# EAGLE design untitled (EAGLE 9.0.1)
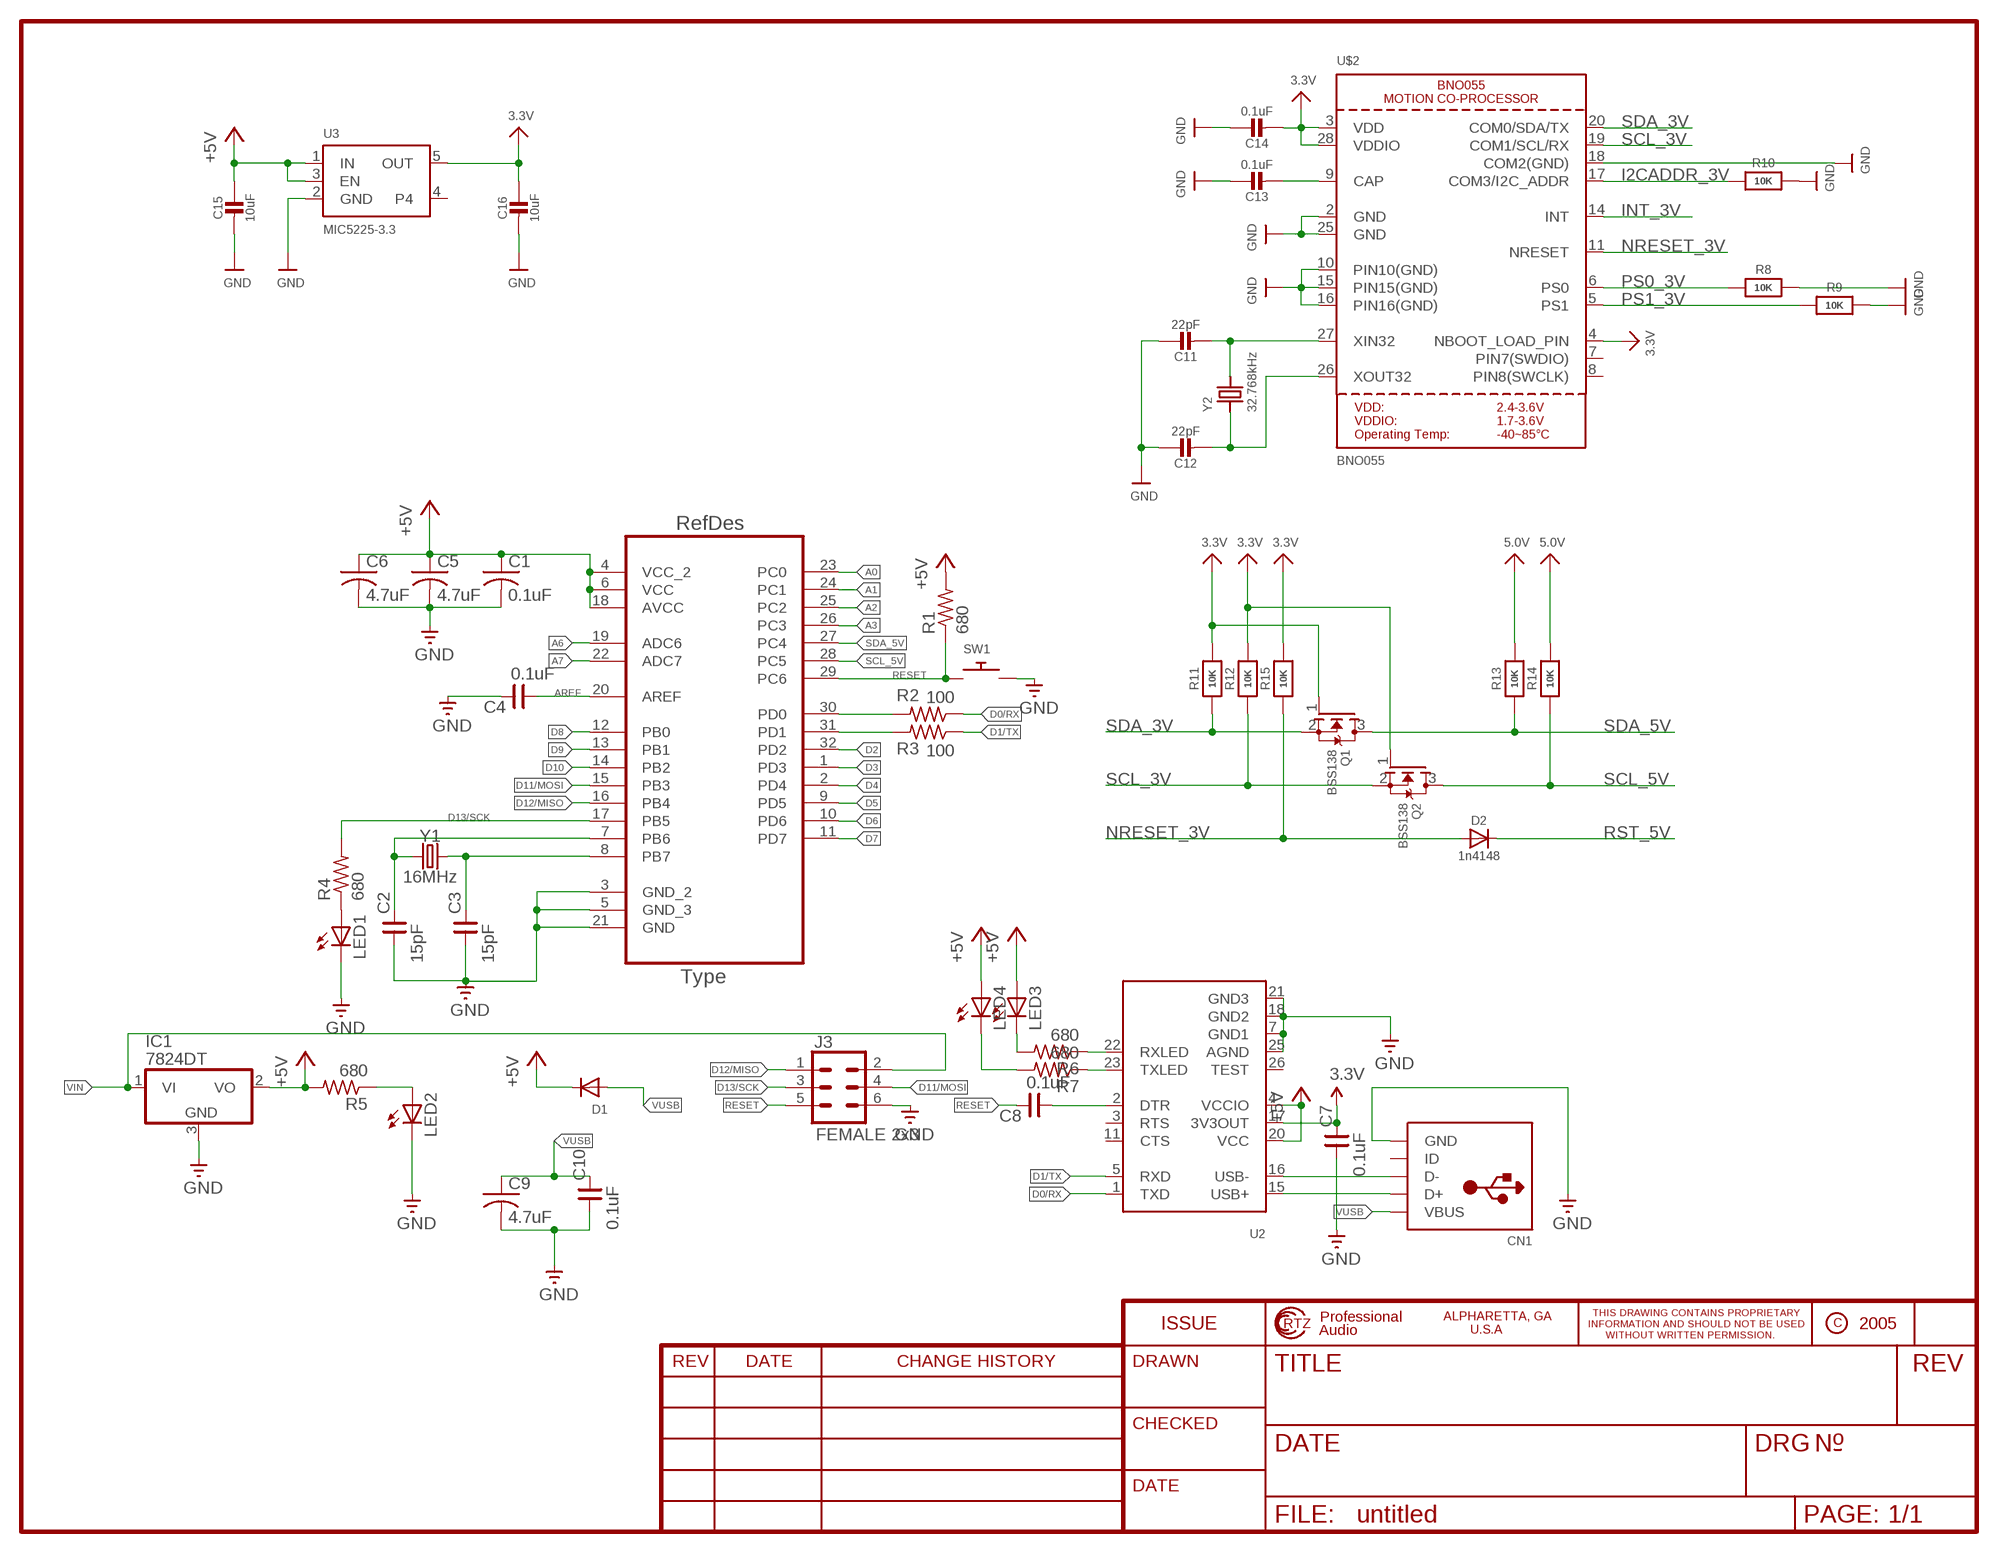
[diagram p0: schematic, sheet 1]

## Parts
C1  0.1uF  C-USC0805  [C0805]
C2  15pF  CNP-0805  [0805]
C3  15pF  CNP-0805  [0805]
C4  0.1uF  CNP-0805  [0805]
C5  4.7uF  C-USC0805  [C0805]
C6  4.7uF  C-USC0805  [C0805]
C7  0.1uF  CNP-0805  [0805]
C8  0.1uF  CNP-0805  [0805]
C9  4.7uF  C-USC0805  [C0805]
C10  0.1uF  CNP-0805  [0805]
C11  22pF  CAP_CERAMIC0805-NOOUTLINE  [0805-NO]
C12  22pF  CAP_CERAMIC0805-NOOUTLINE  [0805-NO]
C13  0.1uF  CAP_CERAMIC0805-NOOUTLINE  [0805-NO]
C14  0.1uF  CAP_CERAMIC0805_10MGAP  [0805_10MGAP]
C15  10uF  CAP_CERAMIC0805-NOOUTLINE  [0805-NO]
C16  10uF  CAP_CERAMIC0805_10MGAP  [0805_10MGAP]
CN1  USBMINIB  [USB-MINIB]
D1  DIODESOD-123  [SOD-123]
D2  1n4148  DIODESOD-323  [SOD-323]
IC1  7824DT  [TO252]
J3  FEMALE 2x3  CONN_03X2FEMALE  [2X3]
LED1  LEDCHIPLED_0805  [CHIPLED_0805]
LED2  LEDCHIPLED_0805  [CHIPLED_0805]
LED3  LEDCHIPLED_0805  [CHIPLED_0805]
LED4  LEDCHIPLED_0805  [CHIPLED_0805]
Q1  BSS138  MOSFET-NWIDE  [SOT23-WIDE]
Q2  BSS138  MOSFET-NWIDE  [SOT23-WIDE]
R1  680  R-US_R0805  [R0805]
R2  100  R-US_R0805  [R0805]
R3  100  R-US_R0805  [R0805]
R4  680  R-US_R0805  [R0805]
R5  680  R-US_R0805  [R0805]
R6  680  R-US_R0805  [R0805]
R7  680  R-US_R0805  [R0805]
R8  10K  RESISTOR0805_NOOUTLINE  [0805-NO]
R9  10K  RESISTOR0805_NOOUTLINE  [0805-NO]
R10  10K  RESISTOR0805_NOOUTLINE  [0805-NO]
R11  10K  RESISTOR0805_NOOUTLINE  [0805-NO]
R12  10K  RESISTOR0805_NOOUTLINE  [0805-NO]
R13  10K  RESISTOR_0805MP  [_0805MP]
R14  10K  RESISTOR_0805MP  [_0805MP]
R15  10K  RESISTOR0805_NOOUTLINE  [0805-NO]
SW1  SWITCH_PUSHBUTTONEVQ-PE  [TACT_PANA-EVQ]
U1  ATMEGA328P-AU  [QFP80P900X900X120-32N]
U2  FT232RLSSOP28  [SSOP28DB]
U3  MIC5225-3.3  VREG_SOT23-5  [SOT23-5]
U$2  BNO055  [BNO055]
Y1  16MHz  CRYSTAL-16MHZPTH-HC49US  [HC49US]
Y2  32.768kHz  CRYSTAL8.0X3.8  [CRYSTAL_8X3.8]

## Nets
3.3V: C7.2 C14.2 C16.1 Q1.1(G) Q2.1(G) R11.2 R12.2 R15.2 U2.17(3V3OUT) U3.5(OUT) U$2.3(VDD) U$2.4(NBOOT_LOAD_PIN) U$2.28(VDDIO)
5.0V: R13.2 R14.2
+5V: C1.1 C5.1 C6.1 C15.1 D1.C IC1.2(VO) LED3.A LED4.A R5.2 U1.4(VCC_2) U1.6(VCC) U1.18(AVCC) U2.4(VCCIO) U2.20(VCC) U3.1(IN) U3.3(EN)
A0: U1.23(PC0)
A1: U1.24(PC1)
A2: U1.25(PC2)
A3: U1.26(PC3)
A6: U1.19(ADC6)
A7: U1.22(ADC7)
AREF: C4.1 U1.20(AREF)
D0/RX: R2.1 U2.1(TXD)
D1/TX: R3.1 U2.5(RXD)
D2: U1.32(PD2)
D3: U1.1(PD3)
D4: U1.2(PD4)
D5: U1.9(PD5)
D6: U1.10(PD6)
D7: U1.11(PD7)
D8: U1.12(PB0)
D9: U1.13(PB1)
D10: U1.14(PB2)
D11/MOSI: J3.4 U1.15(PB3)
D12/MISO: J3.1 U1.16(PB4)
D13/SCK: J3.3 R4.2 U1.17(PB5)
GND: C1.2 C2.1 C3.1 C4.2 C5.2 C6.2 C7.1 C9.2 C10.1 C11.1 C12.1 C13.1 C14.1 C15.2 C16.2 CN1.GND IC1.3(GND) J3.6 LED1.C LED2.C R8.2 R9.2 R10.2 SW1.P$2 U1.3(GND_2) U1.5(GND_3) U1.21(GND) U2.7(GND1) U2.18(GND2) U2.21(GND3) U2.25(AGND) U3.2(GND) U$2.2(GND) U$2.10(PIN10(GND)) U$2.15(PIN15(GND)) U$2.16(PIN16(GND)) U$2.18(COM2(GND)) U$2.25(GND)
I2CADDR_3V: R10.1 U$2.17(COM3/I2C_ADDR)
INT_3V: U$2.14(INT)
N$1: C3.2 U1.8(PB7) Y1.2
N$2: C2.2 U1.7(PB6) Y1.1
N$4: LED2.A R5.1
N$5: CN1.D+ U2.15(USB+)
N$6: CN1.D- U2.16(USB-)
N$7: R2.2 U1.30(PD0)
N$8: R3.2 U1.31(PD1)
N$9: LED3.C R6.2
N$10: C11.2 U$2.27(XIN32) Y2.P$4
N$11: C12.2 U$2.26(XOUT32) Y2.P$1
N$12: R6.1 U2.22(RXLED)
N$13: R7.1 U2.23(TXLED)
N$14: C8.1 U2.2(DTR)
N$15: LED4.C R7.2
N$16: C13.2 U$2.9(CAP)
NRESET_3V: D2.A R15.1 U$2.11(NRESET)
PS0_3V: R8.1 U$2.6(PS0)
PS1_3V: R9.1 U$2.5(PS1)
RESET: C8.2 J3.5 R1.1 SW1.P$1 U1.29(PC6)
RST_5V: D2.C
SCL_3V: Q2.2(S) R12.1 U$2.19(COM1/SCL/RX)
SCL_5V: Q2.3(D) R14.1 U1.28(PC5)
SDA_3V: Q1.2(S) R11.1 U$2.20(COM0/SDA/TX)
SDA_5V: Q1.3(D) R13.1 U1.27(PC4)
VIN: IC1.1(VI) J3.2
VUSB: C9.1 C10.2 CN1.VBUS D1.A
Unconnected: CN1.ID LED1.A R1.2 R4.1 U2.3(RTS) U2.11(CTS) U2.26(TEST) U3.4 U$2.7(PIN7(SWDIO)) U$2.8(PIN8(SWCLK))

## Library data of the parts
C1 C5 C6 C9 = adafruit:C-US: CAPACITOR, American symbol
C2-C4 C7 C8 C10 = cap-master:CNP-: NON-POLARIZED CAP
C11-C16 = microbuilder:CAP_CERAMIC: Ceramic Capacitors For new designs, use the packages preceded by an '_' character since they are more reliable: The following footprints should be used on most boards: _0402 - Standard footprint for regular board layouts _0603 - Standard footprint for regular board layouts _0805 - Standard footprint for regular board layouts _1206 - Standard footprint for regular board layouts For extremely tight-pitch boards where space is at a premium, the following 'micro-pitch' footprints can be used (smaller pads, no silkscreen outline, etc.): _0402MP - Micro-pitch footprint for very dense/compact boards _0603MP - Micro-pitch footprint for very dense/compact boards _0805MP - Micro-pitch footprint for very dense/compact boards _1206MP - Micro-pitch footprint for very dense/compact boards
CN1 = adafruit:USB: USB Connectors USBMINIB - Surface Mount Female Mini-B USB Connector 4UConnector: 06564 By microbuilder.eu Thru-hole RA Female Mini-B USB Connector 4UConnector: 18732 By ladyada.net
D1 = adafruit:DIODE: Diode
D2 = microbuilder:DIODE: Diode
IC1 = adafruit:78*: Positive VOLTAGE REGULATOR Added bigger pads to the TO-92 package
J3 = SparkFun-Connectors:CONN_03X2: Multi connection point. Often used as Generic Header-pin footprint for 0.1 inch spaced/style header connections You can populate with any combo of single row headers, but if you'd like an exact match, check these: Header - 2x3 (Male, 0.1") <https://www.sparkfun.com/products/12807> (PRT-12807) Header - 2x3 (Female, 0.1") <https://www.sparkfun.com/products/13010> (PRT-13010) 2x3 Pin Shrouded Header <https://www.sparkfun.com/products/10877> (PRT-10877) On any of the 0.1 inch spaced packages, you can populate with these: Break Away Headers - Straight <https://www.sparkfun.com/products/116> (PRT-00116) Break Away Male Headers - Right Angle <https://www.sparkfun.com/products/553> (PRT-00553) Female Headers <https://www.sparkfun.com/products/115> (PRT-00115) Break Away Headers - Machine Pin <https://www.sparkfun.com/products/117> (PRT-00117) Break Away Female Headers - Swiss Machine Pin <https://www.sparkfun.com/products/743> (PRT-00743) Special note: the shrouded connector mates well with our 3x2 ribbon cables: Ribbon Crimp Connector - 6-pin (2x3, Female) <https://www.sparkfun.com/products/10651> (PRT-10651) Ribbon Cable - 6 wire (15ft) <https://www.sparkfun.com/products/10646> (PRT-10646); PROD_ID: CONN-11566
LED1-LED4 = adafruit:LED: LED OSRAM: - CHIPLED LG R971, LG N971, LY N971, LG Q971, LY Q971, LO R971, LY R971 LH N974, LH R974 LS Q976, LO Q976, LY Q976 LO Q996 - Hyper CHIPLED LW Q18S LB Q993, LB Q99A, LB R99A - SideLED LS A670, LO A670, LY A670, LG A670, LP A670 LB A673, LV A673, LT A673, LW A673 LH A674 LY A675 LS A676, LA A676, LO A676, LY A676, LW A676 LS A679, LY A679, LG A679 - Hyper Micro SIDELED® LS Y876, LA Y876, LO Y876, LY Y876 LT Y87S - SmartLED LW L88C, LW L88S LB L89C, LB L89S, LG L890 LS L89K, LO L89K, LY L89K LS L896, LA L896, LO L896, LY L896 - TOPLED LS T670, LO T670, LY T670, LG T670, LP T670 LSG T670, LSP T670, LSY T670, LOP T670, LYG T670 LG T671, LOG T671, LSG T671 LB T673, LV T673, LT T673, LW T673 LH T674 LS T676, LA T676, LO T676, LY T676, LB T676, LH T676, LSB T676, LW T676 LB T67C, LV T67C, LT T67C, LS T67K, LO T67K, LY T67K, LW E67C LS E67B, LA E67B, LO E67B, LY E67B, LB E67C, LV E67C, LT E67C LW T67C LS T679, LY T679, LG T679 LS T770, LO T770, LY T770, LG T770, LP T770 LB T773, LV T773, LT T773, LW T773 LH T774 LS E675, LA E675, LY E675, LS T675 LS T776, LA T776, LO T776, LY T776, LB T776 LHGB T686 LT T68C, LB T68C - Hyper Mini TOPLED® LB M676 - Mini TOPLED Santana® LG M470 LS M47K, LO M47K, LY M47K Source: http://www.osram.convergy.de/
Q1 Q2 = microbuilder:MOSFET-N: N-Channel Mosfet LEGEND VDS: Voltage Drain-Source ID: Drain Current RDS(ON): Drain-Source On-State Resistance VGS(TH): Gate-Source Threshold Voltage CISS: Drain-Source Input Capacitance SOT-23 Name VDS ID RDS(ON) VGS(TH) CISS Order Number 2N7002E 60V 260mA 2.5 Ohm 2.5V @ 250uA 26.7pF @ 25V 2N7002ET1GOSTR-ND BSH103 30V 850mA 400 mOhm 400mV @ 1mA 83pF @ 24V BSH103,235-ND BSS138 60V 320mA 1.6 Ohm 1.5V @ 250uA 50pF @ 10V Mouser: 771-BSS138PW115 DMN2075U-7 20V 4.2A 38 mOhm 1V @ 250 uA 594.3pF @ 10V DMN2075U-7DICT-ND * BSS138 good choice for I2C level-shifting POWERPAK 1212-8 Name VDS ID RDS(ON) VGS(TH) CISS Order Number Si7308DN 60V 6A 58 mOhm 3V @ 250uA 665pF @ 15V SI7308DN-T1-E3CT-ND
R1-R7 = adafruit:R-US_: RESISTOR, American symbol
R8-R15 = microbuilder:RESISTOR: Resistors For new designs, use the packages preceded by an '_' character since they are more reliable: The following footprints should be used on most boards: _0402 - Standard footprint for regular board layouts _0603 - Standard footprint for regular board layouts _0805 - Standard footprint for regular board layouts _1206 - Standard footprint for regular board layouts For extremely tight-pitch boards where space is at a premium, the following 'micro-pitch' footprints can be used (smaller pads, no silkscreen outline, etc.): _0402MP - Micro-pitch footprint for very dense/compact boards _0603MP - Micro-pitch footprint for very dense/compact boards _0805MP - Micro-pitch footprint for very dense/compact boards _1206MP - Micro-pitch footprint for very dense/compact boards
SW1 = adafruit:SWITCH_PUSHBUTTON: Buttons SOFTTOUCHSMD_SJ - Soft touch temporary push button (Super Junk Akihabara) Compatible with SKPMANE010 [Mouser: 688-SKPMAN] C&K_KSS = Digikey: KSS221GLFS
U1 = Atmel-ATMEGA328P-AU:ATMEGA328P-AU; DESCRIPTION: 8-bit Microcontroller with In-System Programmable Flash; MPN: ATMEGA328P-AU; OC_FARNELL: 1715486; OC_NEWARK: 14R4631; PACKAGE: TQFP-32; SUPPLIER: Atmel
U2 = microbuilder:FT232RL: FTDI FT232RL USB TO RS232 Converter Digikey: 768-1007-1-ND
U3 = microbuilder:VREG_SOT23-5: SOT23-5 Fixed Voltage Regulators Part Current Out V Out V In V Dropout θJA (°C/W) TJ (°C) Digikey Part No. ADP121 150mA 3.3V 3.4-5.5V 0.09V @ 150mA -- -- ADP121-AUJZ33R7CT-ND ADP121 150mA 3.0V 3.1-5.5V 0.09V @ 150mA -- -- ADP121-AUJZ30R7CT-ND ADP122 300mA 3.3V 3.4-5.5V 0.085V @ 300mA -- -- ADP122AUJZ-3.3-R7CT-ND ADP1712 300mA 3.3V 3.5-5.5V 0.17V @ 300mA -- -- ADP1712AUJZ-3.3-R7TR-ND AP7311 (Low Cost) 150mA 3.3V 3.5-6V 0.15V @ 150mA -- -- AP7311-33WG-7DICT-ND LD39015M18R 150mA 1.8V 1.9V-5.5V 0.08V @ 100mA -- -- 497-6977-1-ND LP2985A-33DBVR 150mA 3.3V 3.3-16V 0.28V @ 150mA 206 150 296-18479-1-ND MCP1824T-3302E/OT 300mA 3.3V 3.5V-6V 0.2V @ 300mA -- -- MCP1824T-3302E/OTCT-ND MIC5205-2.5YM5 TR 150mA 2.5V 2.7-16V 0.165V @ 150mA -- -- 576-1257-2-ND MIC5205-3.0YM5 TR 150mA 3.0V 3.2V-16V 0.165V @ 150mA -- -- 576-1258-2-ND MIC5205-3.3YM5 TR 150mA 3.3V 3.5V-16V 0.165V @ 150mA -- -- 576-1259-2-ND TPS780330220 150mA 3.3V+2.2V 3.6-5.5V 250mV Max -- -- 296-23332-1-ND TDA3663/N1,135 100mA 3.3V 3.5-45V 0.18V @ 50mA -- -- 568-5343-1-ND Max operating temp can be calculated using θJA, TJ (max junction temperature), and power in watts. Set the "Maximum Ambient Temperature" until it reaches TJ ("Max Junction Temperature"), which is the absolute limit for safe use of the regulator: Heat Sink Temperature Calculator <http://www.daycounter.com/Calculators/Heat-Sink-Temperature-Calculator.phtml> For example, With 12V source into a 3.3V LP2985 and a 30mA load, we are dissipating (12V-3.3V) * 0.03A = 0.261W. With a θJA of 206 °C/W, a TJ of 150°C, and 261mW we can safely use the chip without a heat sink up to 75°C (=147.1°C Junction Temperature).
U$2 = microbuilder:BNO055: BNO055 - Motion Co-Processor
Y1 = SparkFun-Clocks:CRYSTAL-16MHZ: 16MHz Crystal Digikey Example <http://www.digikey.com/product-search/en?keywords=535-9122-1-ND> Frequency: 16MHz Frequency Stability: ±50ppm Frequency Tolerance: ±20ppm Load Capacitance: 18pF SparkFun Products: Pro Micro -5V/16MHz <https://www.sparkfun.com/products/12640> SparkFun Serial Enabled LCD Kit <https://www.sparkfun.com/products/10097>; PROD_ID: XTAL-08181; SF_ID: COM-00536
Y2 = microbuilder:CRYSTAL: Crystals HC49UP - Surface Mount Crystal 4.0MHz 18pF +/-30ppm Surface Mount Crystal [Digikey: 535-9857-1-ND] 12.0 MHz Surface Mount Crystal [Digikey: 535-9869-6-ND] 25.0 MHz Surface Mount Crystal [Digikey: 535-9078-1-ND] 2.5 x 2.0mm - MEMs SMT Crystal 16.0 MHz 10pF 20ppm 2.5 x 2.0mm Crystal [Digikey -40-85°C: 535-10923-1-ND] 3.2 x 2.5mm - MEMs SMT Crystal 12.0 MHz 8pF 15ppm 3.2 x 2.5mm Crystal [Digikey: -10-70°C: 644-1047-1-ND -40-125°C: 644-1128-1-ND] 40~85°C cheaper: 644-1173-6-ND 16.0 MHz 8pF 15ppm 3.2 x 2.5mm Crystal [Digikey: -10-70°C: 644-1049-1-ND -40-125°C: 644-1129-2-ND]-40~85°C cheaper: 644-1175-6-ND 16.0 MHz 10pF 10ppm 3.2 x 2.5mm Crystal [Digikey: 644-1100-1-ND] 27.12 MHz 18pF 30ppm 3.2 x 2.5mm Crystal [Digikey: 887-1424-1-ND] 27.12MHz 10pF 10ppm 3.2 x 2.5mm Crystal [Digikey: 887-1329-1-ND] 4.9 x 1.8mm - MEMs SMT Crystal 32.768 KHz 12.5pF 20ppm 4.9 x 1.8mm Crystal [Digikey: SE2415CT-ND] 8.0 x 3.8mm - Surface Mount Crystal 32.768kHz 12.5pF 20ppm -40°C-85°C [Digikey: 535-9166-2-ND] Cylinder 32.768KHz Cylinder Crystal (2x6mm body) [Ex. Digikey: 300-8341-2-ND]

## Board
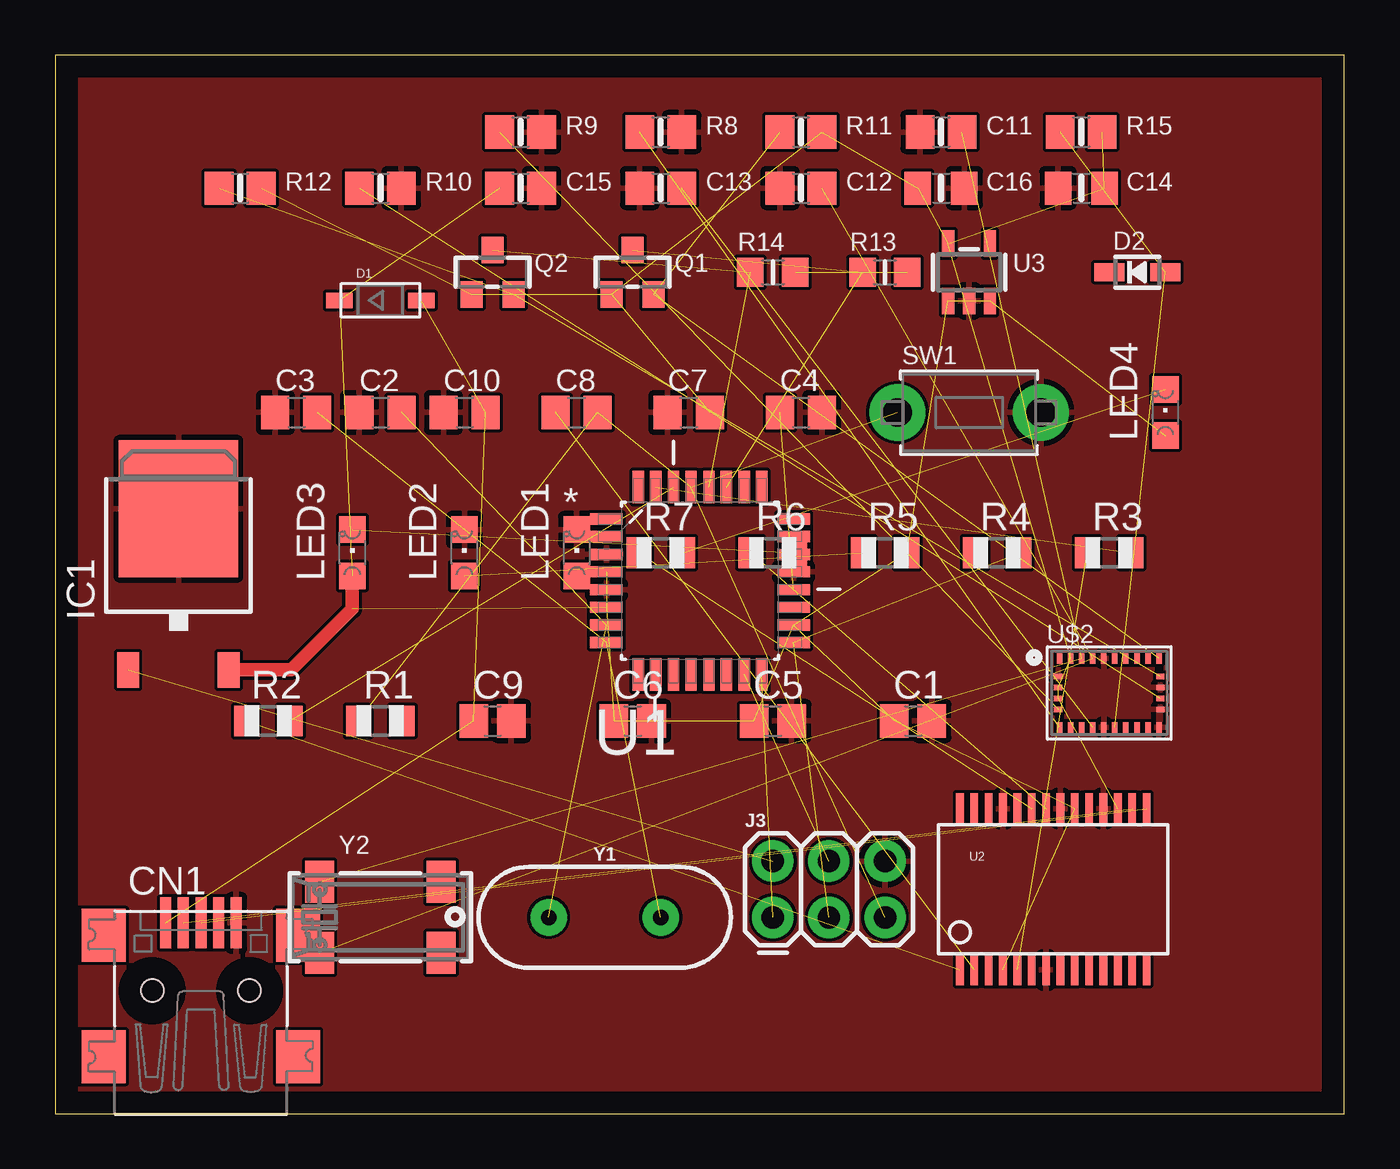
[diagram p1: board, top side]
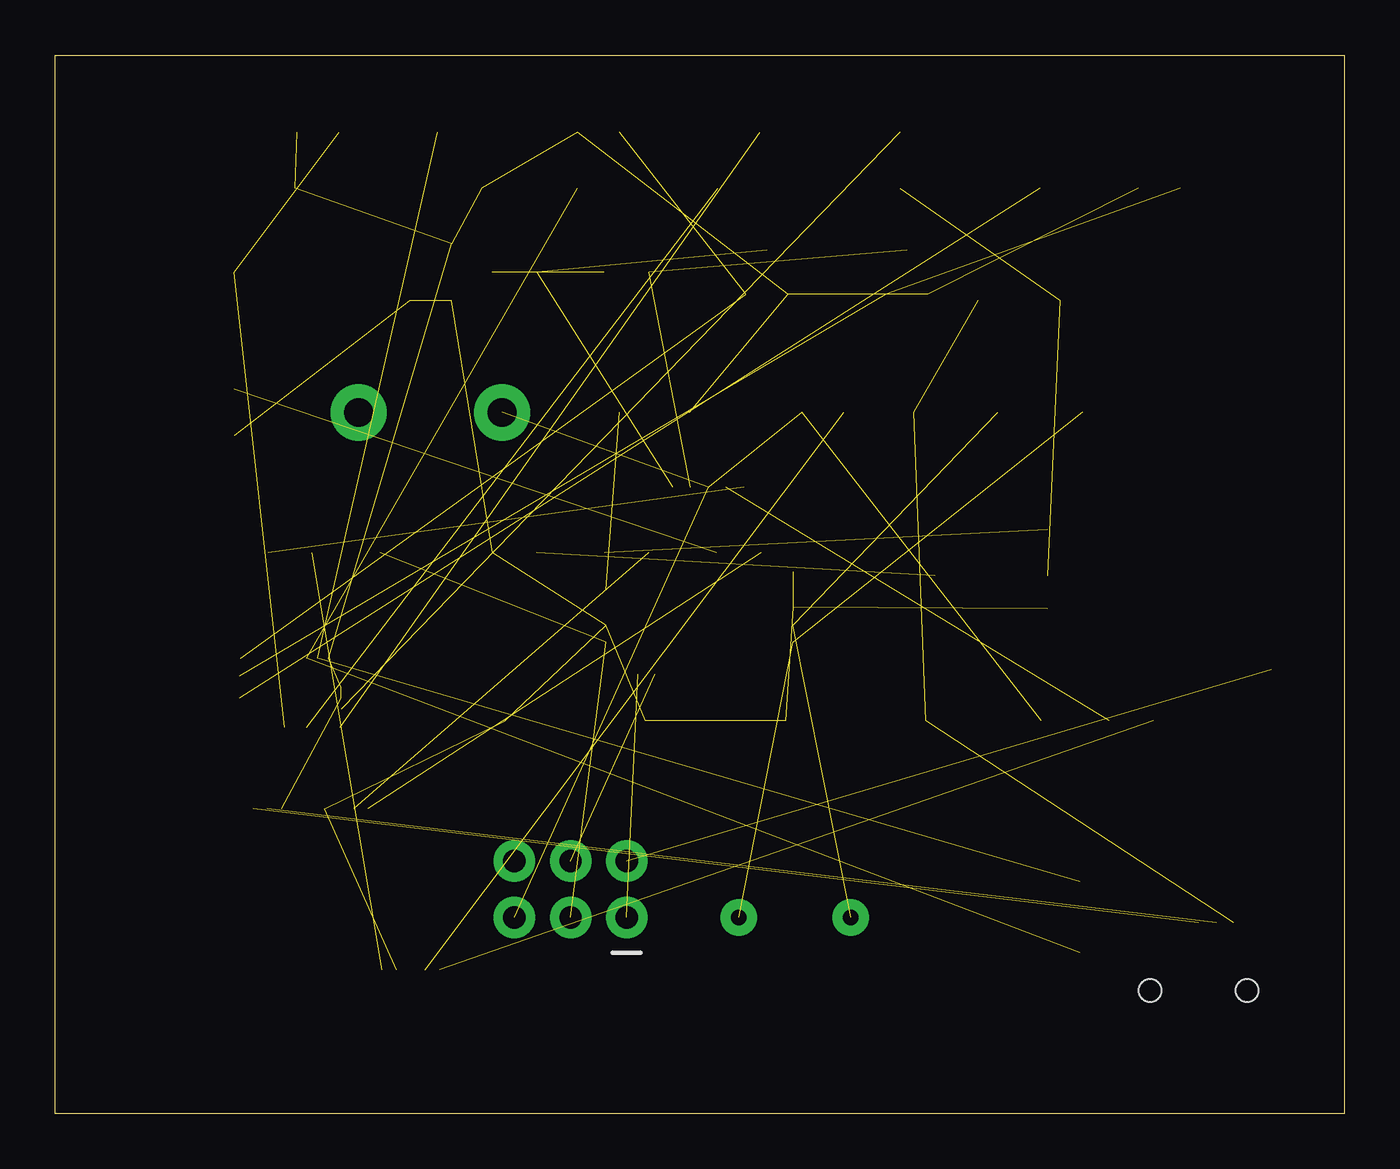
[diagram p2: board, bottom side, seen from below]

Size 58.4 x 47.93 mm. Coordinates in mm from the lower left corner, seen from the top.
Outline: 0,0 58.4,0 58.4,47.93 0,47.93 0,0
Copper layers (1*16): Top 0.035mm / dielectric 1.5mm / Bottom 0.035mm
Design rules "default": minimum track width 6mil, minimum drill 0.35mm, track to track 6mil, track to pad 6mil, pad to pad 6mil, via to via 6mil, smd to smd 6mil, copper to edge 40mil, drill to drill 6mil, minimum pad ring 10mil, minimum via ring 8mil, stop-mask expansion 4mil, vias tented up to drill 0mil, thermal gap 10mil

### Footprints (pad centres in the part's own frame; a part is rotated, then mirrored left to right if it is on the bottom)
C0805 = smd 1.3 x 1.5: 1 -0.85,0; 2 0.85,0
0805 = smd 1.27 x 1.524: 1 -0.953,0; 2 0.953,0
0805-NO = smd 1.3 x 1.5: 1 -0.95,0; 2 0.95,0
0805_10MGAP = smd 1.2 x 1.5: 1 -1.05,0; 2 1.05,0
USB-MINIB = smd 0.5 x 2.308: D+ 0,4.064; D- -0.8,4.064; GND 1.6,4.064; ID 0.8,4.064; VBUS -1.6,4.064 | smd 2 x 2.4: GND1 -4.4,-2; GND2 -4.4,3.5; GND3 4.4,3.5; GND4 4.4,-2 | hole 1: -2.2,1; 2.2,1
SOD-123 = smd 1.2 x 0.7: A 1.85,0; C -1.85,0
SOD-323 = smd 1.35 x 0.8: A 1.27,0; C -1.27,0
TO252 = smd 1 x 1.6: 1 -2.28,-4.8; 2 2.28,-4.8 | smd 5.4 x 6.2: 3 0,2.5
2X3 = drill 1.016 pad 1.88: 1 0,0; 2 0,2.54; 3 2.54,0; 4 2.54,2.54; 5 5.08,0; 6 5.08,2.54
CHIPLED_0805 = smd 1.2 x 1.2: A 0,-1.05; C 0,1.05
SOT23-WIDE = smd 1 x 1.2: 1 -0.95,-1; 2 0.95,-1; 3 0,1
R0805 = smd 1.1 x 1.4: 1 -1,0; 2 1,0
_0805MP = smd 1.2 x 1.3: 1 -1.016,0; 2 1.016,0
TACT_PANA-EVQ = drill 1.3 pad 2.54: P$1 -3.25,0; P$2 3.25,0
QFP80P900X900X120-32N = smd 1.473 x 0.508: 1 -4.242,2.794; 2 -4.242,2.007; 3 -4.242,1.194; 4 -4.242,0.406; 5 -4.242,-0.406; 6 -4.242,-1.194; 7 -4.242,-2.007; 8 -4.242,-2.794; 17 4.242,-2.794; 18 4.242,-2.007; 19 4.242,-1.194; 20 4.242,-0.406; 21 4.242,0.406; 22 4.242,1.194; 23 4.242,2.007; 24 4.242,2.794 | smd 0.508 x 1.473: 9 -2.794,-4.242; 10 -2.007,-4.242; 11 -1.194,-4.242; 12 -0.406,-4.242; 13 0.406,-4.242; 14 1.194,-4.242; 15 2.007,-4.242; 16 2.794,-4.242; 25 2.794,4.242; 26 2.007,4.242; 27 1.194,4.242; 28 0.406,4.242; 29 -0.406,4.242; 30 -1.194,4.242; 31 -2.007,4.242; 32 -2.794,4.242
SSOP28DB = smd 0.348 x 1.397: 1 -4.225,-3.656; 2 -3.575,-3.656; 3 -2.925,-3.656; 4 -2.275,-3.656; 5 -1.625,-3.656; 6 -0.975,-3.656; 7 -0.325,-3.656; 8 0.325,-3.656; 9 0.975,-3.656; 10 1.625,-3.656; 11 2.275,-3.656; 12 2.925,-3.656; 13 3.575,-3.656; 14 4.225,-3.656; 15 4.225,3.656; 16 3.575,3.656; 17 2.925,3.656; 18 2.275,3.656; 19 1.625,3.656; 20 0.975,3.656; 21 0.325,3.656; 22 -0.325,3.656; 23 -0.975,3.656; 24 -1.625,3.656; 25 -2.275,3.656; 26 -2.925,3.656; 27 -3.575,3.656; 28 -4.225,3.656
SOT23-5 = smd 0.55 x 1.2: 1 -0.95,-1.3; 2 0,-1.3; 3 0.95,-1.3; 4 0.95,1.3; 5 -0.95,1.3
BNO055 = smd 0.25 x 0.475: 1 -2.25,1.562; 6 -2.25,-1.562; 7 -1.75,-1.562; 8 -1.25,-1.562; 9 -0.75,-1.562; 10 -0.25,-1.562; 11 0.25,-1.562; 12 0.75,-1.562; 13 1.25,-1.562; 14 1.75,-1.562; 15 2.25,-1.562; 20 2.25,1.562; 21 1.75,1.562; 22 1.25,1.562; 23 0.75,1.562; 24 0.25,1.562; 25 -0.25,1.562; 26 -0.75,1.562; 27 -1.25,1.562; 28 -1.75,1.562 | smd 0.375 x 0.25: 2 -2.312,0.75; 3 -2.312,0.25; 4 -2.312,-0.25; 5 -2.312,-0.75; 16 2.312,-0.75; 17 2.312,-0.25; 18 2.312,0.25; 19 2.312,0.75
HC49US = drill 0.7 pad 1.651: 1 -2.54,0; 2 2.54,0
CRYSTAL_8X3.8 = smd 1.3 x 1.9: P$1 -2.75,-1.6; P$2 2.75,-1.6; P$3 2.75,1.6; P$4 -2.75,1.6

### Placement (x,y rotation side)
C1  38.86,17.78 0 top
C2  14.73,31.75 0 top
C3  10.92,31.75 0 top
C4  33.78,31.75 0 top
C5  32.51,17.78 0 top
C6  26.16,17.78 0 top
C7  28.7,31.75 0 top
C8  23.62,31.75 0 top
C9  19.81,17.78 0 top
C10  18.54,31.75 0 top
C11  40.13,44.45 0 top
C12  33.78,41.91 0 top
C13  27.43,41.91 0 top
C14  46.48,41.91 0 top
C15  21.08,41.91 0 top
C16  40.13,41.91 0 top
CN1  6.6,4.57 0 top
D1  14.73,36.83 0 top
D2  49.02,38.1 0 top
IC1  5.59,24.89 0 top
J3  32.51,8.89 0 top
LED1  23.62,25.4 0 top
LED2  18.54,25.4 0 top
LED3  13.46,25.4 0 top
LED4  50.29,31.75 0 top
Q1  26.16,38.1 0 top
Q2  19.81,38.1 0 top
R1  14.73,17.78 0 top
R2  9.65,17.78 0 top
R3  47.75,25.4 0 top
R4  42.67,25.4 0 top
R5  37.59,25.4 0 top
R6  32.51,25.4 0 top
R7  27.43,25.4 0 top
R8  27.43,44.45 0 top
R9  21.08,44.45 0 top
R10  14.73,41.91 0 top
R11  33.78,44.45 0 top
R12  8.38,41.91 0 top
R13  37.59,38.1 0 top
R14  32.51,38.1 0 top
R15  46.48,44.45 0 top
SW1  41.4,31.75 0 top
U1  29.21,24.13 0 top
U2  45.21,10.16 0 top
U3  41.4,38.1 0 top
U$2  47.75,19.05 0 top
Y1  24.89,8.89 0 top
Y2  14.73,8.89 0 top

### Tracks (layer width: path | path; a pad name or v marks a point on that pad's centre or on a via)
3.3V  (12 unrouted)
5.0V  (1 unrouted)
+5V  (14 unrouted)
  Top 0.61: IC1.2 10.69,20.09 13.46,22.86 LED3.A
AREF  (1 unrouted)
D0/RX  (1 unrouted)
D1/TX  (1 unrouted)
D11/MOSI  (1 unrouted)
D12/MISO  (1 unrouted)
D13/SCK  (2 unrouted)
GND
  pour Top: 0,0 0,47.75 58.67,47.75 58.67,0
I2CADDR_3V  (1 unrouted)
N$1  (2 unrouted)
N$2  (2 unrouted)
N$4  (1 unrouted)
N$5  (1 unrouted)
N$6  (1 unrouted)
N$7  (1 unrouted)
N$8  (1 unrouted)
N$9  (1 unrouted)
N$10  (2 unrouted)
N$11  (2 unrouted)
N$12  (1 unrouted)
N$13  (1 unrouted)
N$14  (1 unrouted)
N$15  (1 unrouted)
N$16  (1 unrouted)
NRESET_3V  (2 unrouted)
PS0_3V  (1 unrouted)
PS1_3V  (1 unrouted)
RESET  (4 unrouted)
SCL_3V  (2 unrouted)
SCL_5V  (2 unrouted)
SDA_3V  (2 unrouted)
SDA_5V  (2 unrouted)
VIN  (1 unrouted)
VUSB  (3 unrouted)